# Altium schematic sheet CNY.SchDoc
size A4
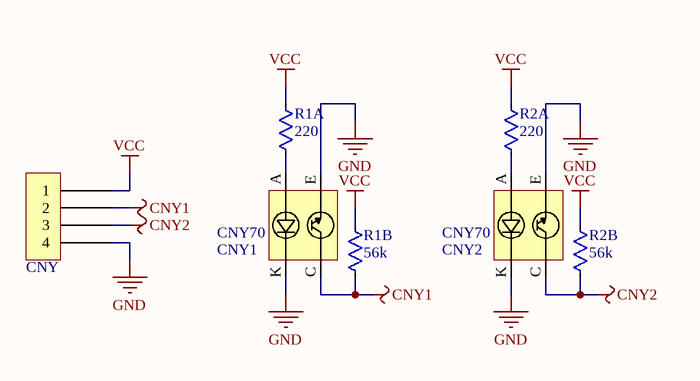
[diagram p0: CNY.SchDoc]

## Parts
CNY  Header 1x4  [Header 1x4]  (value not drawn)
CNY1  CNY70  [CNY70_LIB]
CNY2  CNY70  [CNY70_LIB]
R1A  value 220  [RES-Axial-400mil]  (hidden comment: RES)
R1B  value 56k  [RES-Axial-400mil]  (hidden comment: RES)
R2A  value 220  [RES-Axial-400mil]  (hidden comment: RES)
R2B  value 56k  [RES-Axial-400mil]  (hidden comment: RES)

## Nets
CNY1: CNY.2 CNY1.C R1B.1
CNY2: CNY.3 CNY2.C R2B.1
GND: CNY.4 CNY1.E CNY1.K CNY2.E CNY2.K
VCC: CNY.1 R1A.2 R1B.2 R2A.2 R2B.2
NetCNY1_A: CNY1.A R1A.1
NetCNY2_A: CNY2.A R2A.1